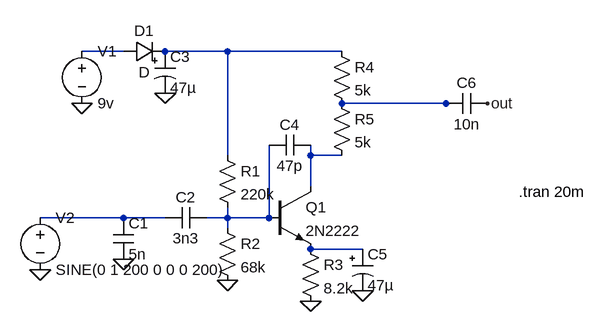
[diagram p0: schematic naga-viper.asc]
naga-viper.asc, the LTspice schematic file:
Version 4
SHEET 1 880 680
WIRE 64 144 0 144
WIRE 224 144 128 144
WIRE 400 144 224 144
WIRE 560 224 400 224
WIRE 576 224 560 224
WIRE 224 304 224 144
WIRE 352 304 352 288
WIRE 400 304 352 304
WIRE 352 352 352 304
WIRE 64 400 -64 400
WIRE 128 400 64 400
WIRE 224 400 224 384
WIRE 224 400 192 400
WIRE 288 400 288 288
WIRE 288 400 224 400
WIRE 224 416 224 400
WIRE 432 448 352 448
FLAG 0 224 0
FLAG -64 480 0
FLAG 64 464 0
FLAG 224 496 0
FLAG 432 512 0
FLAG 352 528 0
FLAG 128 208 0
FLAG 624 224 out
SYMBOL voltage 0 128 R0
SYMATTR InstName V1
SYMATTR Value 9v
SYMBOL voltage -64 384 R0
SYMATTR InstName V2
SYMATTR Value SINE(0 1 200 0 0 0 200)
SYMBOL cap 48 400 R0
SYMATTR InstName C1
SYMATTR Value 5n
SYMBOL cap 192 384 R90
WINDOW 0 0 32 VBottom 2
WINDOW 3 32 32 VTop 2
SYMATTR InstName C2
SYMATTR Value 3n3
SYMBOL res 208 288 R0
SYMATTR InstName R1
SYMATTR Value 220k
SYMBOL res 208 400 R0
SYMATTR InstName R2
SYMATTR Value 68k
SYMBOL diode 64 160 R270
WINDOW 0 32 32 VTop 2
WINDOW 3 0 32 VBottom 2
SYMATTR InstName D1
SYMBOL polcap 112 144 R0
SYMATTR InstName C3
SYMATTR Value 47µ
SYMBOL npn 288 352 R0
SYMATTR InstName Q1
SYMATTR Value 2N2222
SYMBOL cap 352 272 R90
WINDOW 0 0 32 VBottom 2
WINDOW 3 32 32 VTop 2
SYMATTR InstName C4
SYMATTR Value 47p
SYMBOL res 336 432 R0
SYMATTR InstName R3
SYMATTR Value 8.2k
SYMBOL polcap 416 448 R0
SYMATTR InstName C5
SYMATTR Value 47µ
SYMBOL res 384 128 R0
SYMATTR InstName R4
SYMATTR Value 5k
SYMBOL res 384 208 R0
SYMATTR InstName R5
SYMATTR Value 5k
SYMBOL cap 624 208 R90
WINDOW 0 0 32 VBottom 2
WINDOW 3 32 32 VTop 2
SYMATTR InstName C6
SYMATTR Value 10n
TEXT 672 360 Left 2 !.tran 20m

The netlist it stands for:
* naga-viper.asc
V1 N001 0 9v
V2 N005 0 SINE(0 1 200 0 0 0 200)
C1 N005 0 5n
C2 N006 N005 3n3
R1 N002 N006 220k
R2 N006 0 68k
D1 N001 N002 D
C3 N002 0 47µ
Q1 N004 N006 N007 0 2N2222
C4 N004 N006 47p
R3 N007 0 8.2k
C5 N007 0 47µ
R4 N002 N003 5k
R5 N003 N004 5k
C6 out N003 10n
.model D D
.lib standard.dio
.model NPN NPN
.model PNP PNP
.lib standard.bjt
.tran 20m
.backanno
.end